# EAGLE design GP4SF1109F2 (EAGLE 8.3.1)
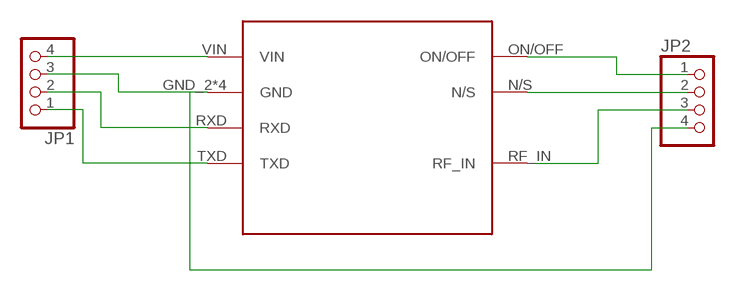
[diagram p0: schematic, sheet 1]

## Parts
JP1  PINHD-1X4  [1X04]
JP2  PINHD-1X4  [1X04]
U$1  GP4SF1109F2  [GP4SF1109F2]

## Nets
N$1: JP1.4 U$1.VIN
N$2: JP1.3 JP2.4 U$1.GND_2(GND) U$1.GND_5(GND) U$1.GND_6(GND) U$1.GND_8(GND)
N$3: JP1.2 U$1.RXD
N$4: JP1.1 U$1.TXD
N$5: JP2.1 U$1.ON/OFF
N$6: JP2.2 U$1.N/S
N$7: JP2.3 U$1.RF_IN

## Library data of the parts
JP1 JP2 = pinhead:PINHD-1X4: PIN HEADER
U$1 = mgvc:GP4SF1109F2: GPS module GP4SF1109F2

## Board
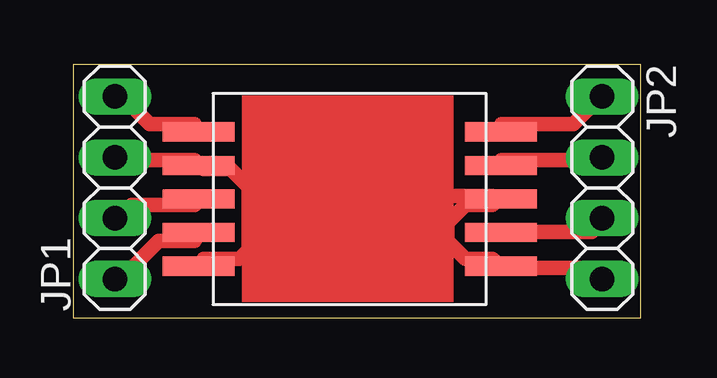
[diagram p1: board, top side]

Size 23.67 x 10.56 mm. Coordinates in mm from the lower left corner, seen from the top.
Outline: 0,0 23.67,0 23.67,10.56 0,10.56 0,0
Copper layers (1*16): Top 0.035mm / dielectric 1.5mm / Bottom 0.035mm
Design rules "default *": minimum track width 0.6mm, minimum drill 0.35mm, track to track 6mil, track to pad 6mil, pad to pad 6mil, via to via 6mil, smd to smd 6mil, copper to edge 40mil, drill to drill 6mil, minimum pad ring 10mil, minimum via ring 8mil, stop-mask expansion 4mil, vias tented up to drill 0mil, thermal gap 10mil

### Footprints (pad centres in the part's own frame; a part is rotated, then mirrored left to right if it is on the bottom)
1X04 = drill 1.016 long: 1 -3.81,0; 2 -1.27,0; 3 1.27,0; 4 3.81,0
GP4SF1109F2 = smd 3 x 0.8: GND_2 -5.4,2.2; GND_5 -5.4,-2; GND_6 7.2,-2; GND_8 7.2,0.8; N/S 7.2,2.2; ON/OFF 7.2,3.6; RF_IN 7.2,-0.6; RXD -5.4,0.8; TXD -5.4,-0.6; VIN -5.4,3.6

### Placement (x,y rotation side)
JP1  1.74,5.42 90 top
JP2  22.06,5.42 270 top
U$1  10.63,4.15 0 top

### Tracks (layer width: path | path; a pad name or v marks a point on that pad's centre or on a via)
N$1
  Top 0.6: U$1.VIN 5.07,8.09 3.19,8.09 2.06,9.21 JP1.4
N$2
  Top 0.6: JP2.4 22,1.69 21.62,2.07 17.86,2.07 U$1.GND_6 17.48,2.44 16.36,2.44 15.6,3.2 15.6,3.95 16.36,4.7 17.48,4.7 U$1.GND_8 17.48,5.08 7.33,5.08 | 7.33,5.08 7.33,5.45 6.58,6.21 5.45,6.21 U$1.GND_2 5.07,6.58 2.06,6.58 JP1.3 | 7.33,5.08 7.33,2.82 6.95,2.44 5.45,2.44 U$1.GND_5
N$3
  Top 0.6: U$1.RXD 5.07,4.7 2.44,4.7 2.06,4.32 JP1.2
N$4
  Top 0.6: U$1.TXD 5.07,3.2 3.57,3.2 2.06,1.69 JP1.1
N$5
  Top 0.6: U$1.ON/OFF 17.86,8.09 20.87,8.09 22,9.21 JP2.1
N$6
  Top 0.6: U$1.N/S 17.86,6.58 22,6.58 JP2.2
N$7
  Top 0.6: U$1.RF_IN 17.86,3.57 21.62,3.57 22,3.95 JP2.3
(copper drawn outside any net)
  shapes: Top area x1